# EAGLE design 511_outin_things_imx7 (EAGLE 9.6.2)
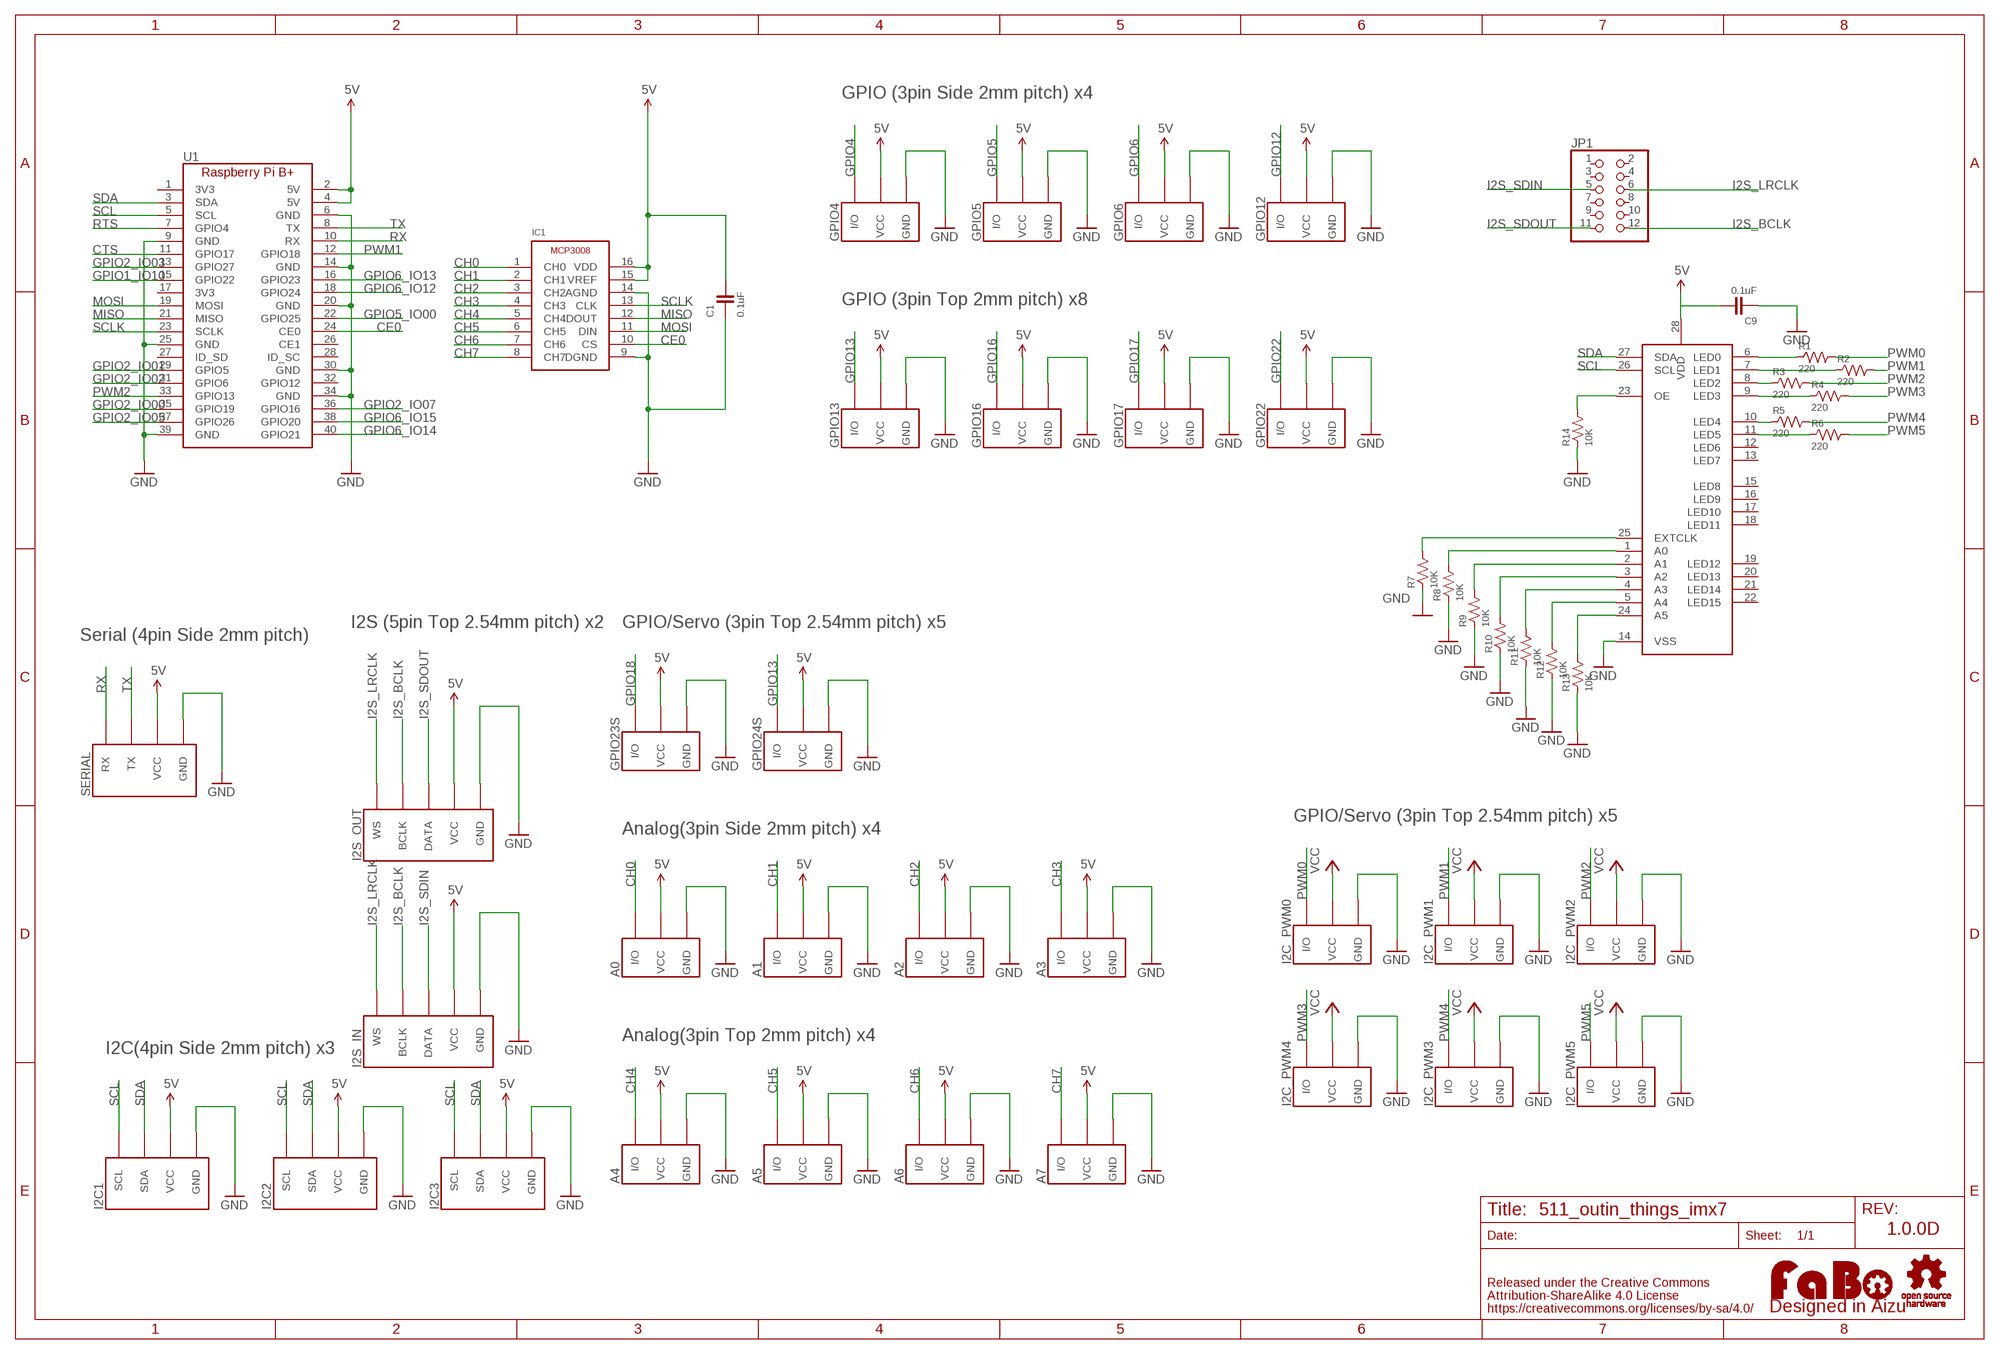
[diagram p0: schematic, sheet 1]

## Parts
A0  FABO_BRICK_3PIN-S03B-PASK-2  [FABO_BRICK_3PIN_S03B-PASK-2]
A1  FABO_BRICK_3PIN-S03B-PASK-2  [FABO_BRICK_3PIN_S03B-PASK-2]
A2  FABO_BRICK_3PIN-S03B-PASK-2  [FABO_BRICK_3PIN_S03B-PASK-2]
A3  FABO_BRICK_3PIN-S03B-PASK-2  [FABO_BRICK_3PIN_S03B-PASK-2]
A4  FABO_BRICK_3PIN-B03B-PASK-1  [FABO_BRICK_3PIN_B03B-PASK-1]
A5  FABO_BRICK_3PIN-B03B-PASK-1  [FABO_BRICK_3PIN_B03B-PASK-1]
A6  FABO_BRICK_3PIN-B03B-PASK-1  [FABO_BRICK_3PIN_B03B-PASK-1]
A7  FABO_BRICK_3PIN-B03B-PASK-1  [FABO_BRICK_3PIN_B03B-PASK-1]
C1  0.1uF  CAPACITOR-0603  [0603]
C9  0.1uF  CAPACITOR-0603  [0603]
GPIO4  FABO_BRICK_3PIN-S03B-PASK-2  [FABO_BRICK_3PIN_S03B-PASK-2]
GPIO5  FABO_BRICK_3PIN-S03B-PASK-2  [FABO_BRICK_3PIN_S03B-PASK-2]
GPIO6  FABO_BRICK_3PIN-S03B-PASK-2  [FABO_BRICK_3PIN_S03B-PASK-2]
GPIO12  FABO_BRICK_3PIN-S03B-PASK-2  [FABO_BRICK_3PIN_S03B-PASK-2]
GPIO13  FABO_BRICK_3PIN-B03B-PASK-1  [FABO_BRICK_3PIN_B03B-PASK-1]
GPIO16  FABO_BRICK_3PIN-B03B-PASK-1  [FABO_BRICK_3PIN_B03B-PASK-1]
GPIO17  FABO_BRICK_3PIN-B03B-PASK-1  [FABO_BRICK_3PIN_B03B-PASK-1]
GPIO22  FABO_BRICK_3PIN-B03B-PASK-1  [FABO_BRICK_3PIN_B03B-PASK-1]
GPIO23S  FABO_BRICK_3PIN-HEADER  [FABO_BRICK_3PIN_HEADER]
GPIO24S  FABO_BRICK_3PIN-HEADER  [FABO_BRICK_3PIN_HEADER]
I2C1  FABO_BRICK_I2C-S04B-PASK-2  [FABO_BRICK_I2C_S04B-PASK-2]
I2C2  FABO_BRICK_I2C-S04B-PASK-2  [FABO_BRICK_I2C_S04B-PASK-2]
I2C3  FABO_BRICK_I2C-S04B-PASK-2  [FABO_BRICK_I2C_S04B-PASK-2]
I2C_PWM0  FABO_BRICK_3PIN-HEADER  [FABO_BRICK_3PIN_HEADER]
I2C_PWM1  FABO_BRICK_3PIN-HEADER  [FABO_BRICK_3PIN_HEADER]
I2C_PWM2  FABO_BRICK_3PIN-HEADER  [FABO_BRICK_3PIN_HEADER]
I2C_PWM3  FABO_BRICK_3PIN-HEADER  [FABO_BRICK_3PIN_HEADER]
I2C_PWM4  FABO_BRICK_3PIN-HEADER  [FABO_BRICK_3PIN_HEADER]
I2C_PWM5  FABO_BRICK_3PIN-HEADER  [FABO_BRICK_3PIN_HEADER]
I2S_IN  FABO_BRICK_I2STOP  [FABO_BRICK_I2S_B05B-PARK-1]
I2S_OUT  FABO_BRICK_I2STOP  [FABO_BRICK_I2S_B05B-PARK-1]
IC1  MICROCHIP-MCP3008  [MICROCHIP-MCP3008]
JP1  PINHD-2X6  [2X06]
LOGO1  LOGO_FABO-M  [LOGO_FABO_M]
R1  220  RESISTOR-0603  [0603]
R2  220  RESISTOR-0603  [0603]
R3  220  RESISTOR-0603  [0603]
R4  220  RESISTOR-0603  [0603]
R5  220  RESISTOR-0603  [0603]
R6  220  RESISTOR-0603  [0603]
R7  10K  RESISTOR-0603  [0603]
R8  10K  RESISTOR-0603  [0603]
R9  10K  RESISTOR-0603  [0603]
R10  10K  RESISTOR-0603  [0603]
R11  10K  RESISTOR-0603  [0603]
R12  10K  RESISTOR-0603  [0603]
R13  10K  RESISTOR-0603  [0603]
R14  10K  RESISTOR-0603  [0603]
SERIAL  FABO_BRICK_SERIAL-S04B-PASK-2  [FABO_BRICK_SERIAL_S04B-PASK-2]
U1  RASPBERRY_PI_B+  [RASPBERRY_PI_B+]
U$4  LOGO_OSHW-T_M_BOTTOM  [LOGO_OSHW_T_MS_BOTTOM]
U$9  PCA9685  [PCA9685]

## Nets
5V: A0.VCC A1.VCC A2.VCC A3.VCC A4.VCC A5.VCC A6.VCC A7.VCC C1.2 C9.2 GPIO4.VCC GPIO5.VCC GPIO6.VCC GPIO12.VCC GPIO13.VCC GPIO16.VCC GPIO17.VCC GPIO22.VCC GPIO23S.VCC GPIO24S.VCC I2C1.VCC I2C2.VCC I2C3.VCC I2S_IN.VCC I2S_OUT.VCC IC1.15(VREF) IC1.16(VDD) SERIAL.VCC U1.2(5V) U1.4(5V) U$9.28(VDD)
CE0: IC1.10(CS) U1.24(CE0)
CH0: A0.I/O IC1.1(CH0)
CH1: A1.I/O IC1.2(CH1)
CH2: A2.I/O IC1.3(CH2)
CH3: A3.I/O IC1.4(CH3)
CH4: A4.I/O IC1.5(CH4)
CH5: A5.I/O IC1.6(CH5)
CH6: A6.I/O IC1.7(CH6)
CH7: A7.I/O IC1.8(CH7)
CTS: U1.11(GPIO17)
GND: A0.GND A1.GND A2.GND A3.GND A4.GND A5.GND A6.GND A7.GND C1.1 C9.1 GPIO4.GND GPIO5.GND GPIO6.GND GPIO12.GND GPIO13.GND GPIO16.GND GPIO17.GND GPIO22.GND GPIO23S.GND GPIO24S.GND I2C1.GND I2C2.GND I2C3.GND I2C_PWM0.GND I2C_PWM1.GND I2C_PWM2.GND I2C_PWM3.GND I2C_PWM4.GND I2C_PWM5.GND I2S_IN.GND I2S_OUT.GND IC1.9(DGND) IC1.14(AGND) R7.1 R8.1 R9.1 R10.1 R11.1 R12.1 R13.1 R14.1 SERIAL.GND U1.6(GND) U1.9(GND) U1.14(GND) U1.20(GND) U1.25(GND) U1.30(GND) U1.34(GND) U1.39(GND) U$9.14(VSS)
GPIO1_IO10: U1.15(GPIO22)
GPIO2_IO00: U1.35(GPIO19)
GPIO2_IO01: U1.29(GPIO5)
GPIO2_IO02: U1.31(GPIO6)
GPIO2_IO03: U1.13(GPIO27)
GPIO2_IO05: U1.37(GPIO26)
GPIO2_IO07: U1.36(GPIO16)
GPIO4: GPIO4.I/O
GPIO5: GPIO5.I/O
GPIO5_IO00: U1.22(GPIO25)
GPIO6: GPIO6.I/O
GPIO6_IO12: U1.18(GPIO24)
GPIO6_IO13: U1.16(GPIO23)
GPIO6_IO14: U1.40(GPIO21)
GPIO6_IO15: U1.38(GPIO20)
GPIO12: GPIO12.I/O
GPIO13: GPIO13.I/O GPIO24S.I/O
GPIO16: GPIO16.I/O
GPIO17: GPIO17.I/O
GPIO18: GPIO23S.I/O
GPIO22: GPIO22.I/O
I2S_BCLK: I2S_IN.BCLK I2S_OUT.BCLK JP1.12
I2S_LRCLK: I2S_IN.WS I2S_OUT.WS JP1.6
I2S_SDIN: I2S_IN.DATA JP1.5
I2S_SDOUT: I2S_OUT.DATA JP1.11
LED0: R1.1 U$9.6(LED0)
LED1: R2.1 U$9.7(LED1)
LED2: R3.1 U$9.8(LED2)
LED3: R4.1 U$9.9(LED3)
LED4: R5.1 U$9.10(LED4)
LED5: R6.1 U$9.11(LED5)
MISO: IC1.12(DOUT) U1.21(MISO)
MOSI: IC1.11(DIN) U1.19(MOSI)
N$7: R14.2 U$9.23(OE)
N$8: R7.2 U$9.25(EXTCLK)
N$9: R8.2 U$9.1(A0)
N$10: R9.2 U$9.2(A1)
N$11: R10.2 U$9.3(A2)
N$12: R11.2 U$9.4(A3)
N$13: R12.2 U$9.5(A4)
N$14: R13.2 U$9.24(A5)
PWM0: I2C_PWM0.I/O R1.2
PWM1: I2C_PWM1.I/O R2.2 U1.12(GPIO18)
PWM2: I2C_PWM2.I/O R3.2 U1.33(GPIO13)
PWM3: I2C_PWM4.I/O R4.2
PWM4: I2C_PWM3.I/O R5.2
PWM5: I2C_PWM5.I/O R6.2
RTS: U1.7(GPIO4)
RX: SERIAL.RX U1.10(RX)
SCL: I2C1.SCL I2C2.SCL I2C3.SCL U1.5(SCL) U$9.26(SCL)
SCLK: IC1.13(CLK) U1.23(SCLK)
SDA: I2C1.SDA I2C2.SDA I2C3.SDA U1.3(SDA) U$9.27(SDA)
TX: SERIAL.TX U1.8(TX)
VCC: I2C_PWM0.VCC I2C_PWM1.VCC I2C_PWM2.VCC I2C_PWM3.VCC I2C_PWM4.VCC I2C_PWM5.VCC
Unconnected: JP1.1 JP1.2 JP1.3 JP1.4 JP1.7 JP1.8 JP1.9 JP1.10 U1.1(3V3) U1.17(3V3) U1.26(CE1) U1.27(ID_SD) U1.28(ID_SC) U1.32(GPIO12) U$9.12(LED6) U$9.13(LED7) U$9.15(LED8) U$9.16(LED9) U$9.17(LED10) U$9.18(LED11) U$9.19(LED12) U$9.20(LED13) U$9.21(LED14) U$9.22(LED15)

## Notes on the sheet
- GPIO (3pin Side 2mm pitch) x4
- GPIO (3pin Top 2mm pitch) x8
- I2S (5pin Top 2.54mm pitch) x2 | GPIO/Servo (3pin Top 2.54mm pitch) x5
- Serial (4pin Side 2mm pitch)
- GPIO/Servo (3pin Top 2.54mm pitch) x5
- Analog(3pin Side 2mm pitch) x4
- Analog(3pin Top 2mm pitch) x4
- I2C(4pin Side 2mm pitch) x3
- 1.0.0D

## Library data of the parts
A0 A1-A7 GPIO4-GPIO6 GPIO12 GPIO13 GPIO16 GPIO17 GPIO22 GPIO23S GPIO24S I2C_PWM0 I2C_PWM1-I2C_PWM5 = FaBo-Template:FABO_BRICK_3PIN: FaBo Brick 3pin
C1 C9 = FaBo-Capacitor:CAPACITOR: CAPACITOR
I2C1-I2C3 = FaBo-Template:FABO_BRICK_I2C: FaBo Brick I2C
I2S_IN I2S_OUT = FaBo-Template:FABO_BRICK_I2S
IC1 = FaBo-ADC:MICROCHIP-MCP3008
JP1 = pinhead:PINHD-2X6: PIN HEADER
LOGO1 = component:LOGO_FABO
R1-R14 = FaBo-Resistors:RESISTOR: RESISTOR
SERIAL = FaBo-Template:FABO_BRICK_SERIAL: FaBo Brick Serial
U1 = FaBo-Boards:RASPBERRY_PI_B+
U$4 = FaBo-etc:LOGO_OSHW
U$9 = FaBo-Motor:PCA9685

## Board
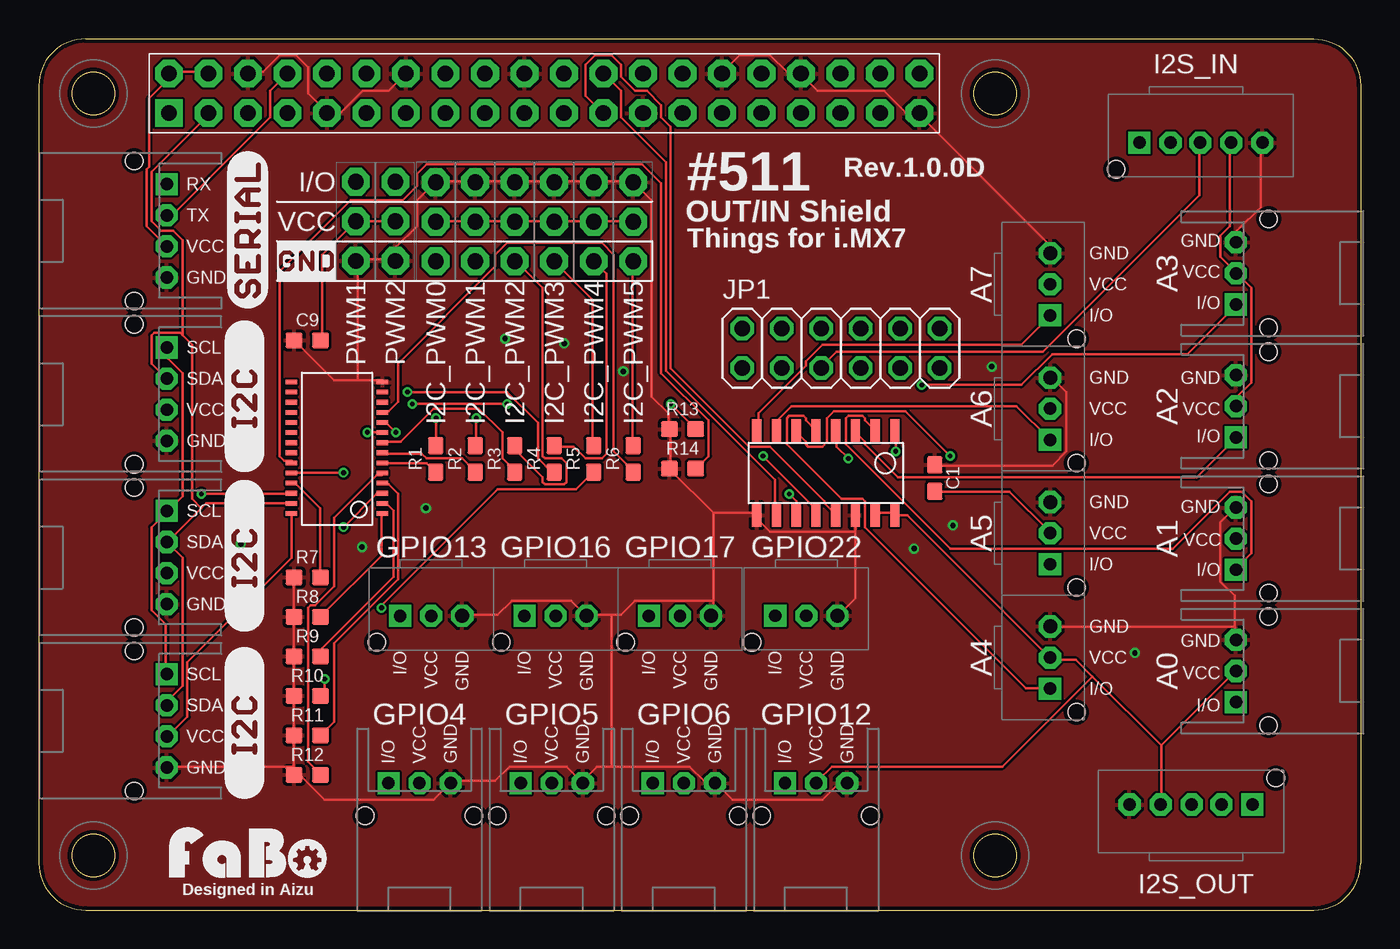
[diagram p1: board, top side]
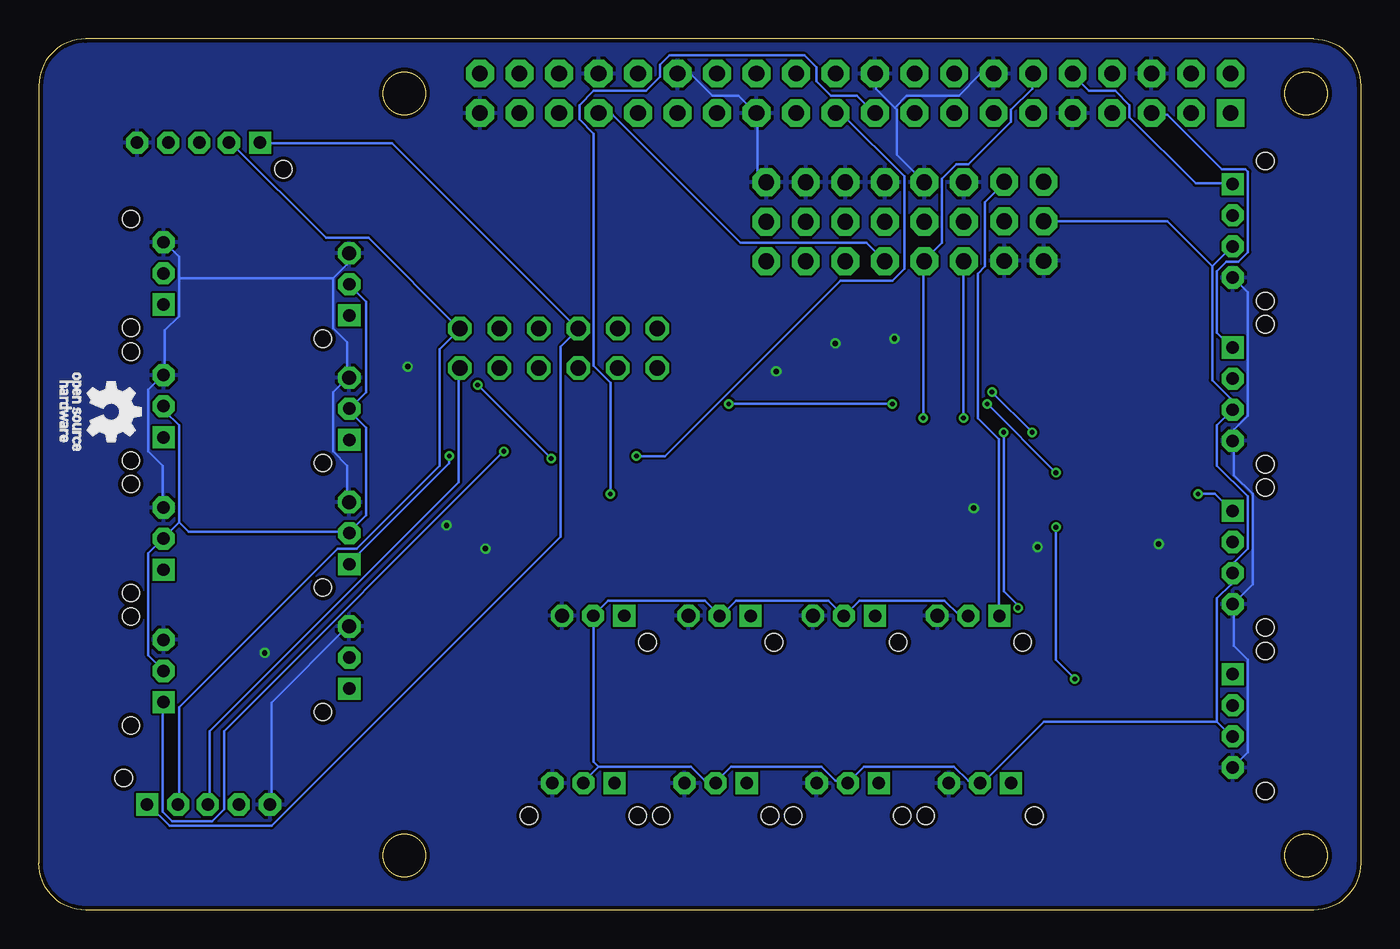
[diagram p2: board, bottom side, seen from below]

Size 85 x 56 mm. Coordinates in mm from the lower left corner, seen from the top.
Copper layers (1*16): Top 0.035mm / dielectric 1.6mm / Bottom 0.035mm
Design rules "PCBway": minimum track width 6mil, minimum drill 12mil, track to track 6mil, track to pad 6mil, pad to pad 6mil, via to via 6mil, smd to smd 6mil, copper to edge 10mil, drill to drill 10mil, minimum pad ring 10mil, minimum via ring 6mil, stop-mask expansion 2mil, vias tented up to drill 100mil, thermal gap 8mil

### Footprints (pad centres in the part's own frame; a part is rotated, then mirrored left to right if it is on the bottom)
FABO_BRICK_3PIN_S03B-PASK-2 = drill 0.8 pad 1.422 octagon: GND -2,0; VCC 0,0 | drill 0.8 pad 1.422 square: I/O 2,0 | hole 1.1: 3.5,2.1; -3.5,2.1
FABO_BRICK_3PIN_B03B-PASK-1 = drill 0.9 pad 1.422 octagon: GND -2,0 | drill 0.8 pad 1.422 square: I/O 2,0 | drill 0.8 pad 1.422 octagon: VCC 0,0 | hole 1.1: 3.5,1.7
0603 = smd 1.1 x 1: 1 -0.85,0; 2 0.85,0
FABO_BRICK_3PIN_HEADER = drill 1 pad 1.778 octagon: GND -2.54,0; I/O 2.54,0; VCC 0,0
FABO_BRICK_I2C_S04B-PASK-2 = drill 0.8 pad 1.422 octagon: GND -3,0; SDA 1,0; VCC -1,0 | drill 0.8 pad 1.422 square: SCL 3,0 | hole 1.1: 4.5,2.1; -4.5,2.1
FABO_BRICK_I2S_B05B-PARK-1 = drill 0.8 pad 1.422 octagon: BCLK 1.635,2.54; DATA -0.27,2.54; GND -4.27,2.54; VCC -2.27,2.54 | drill 0.8 pad 1.422 square: WS 3.635,2.54 | hole 1.1: 5.135,4.24
MICROCHIP-MCP3008 = smd 0.6 x 1.5: 1 -4.445,-2.7; 2 -3.175,-2.7; 3 -1.905,-2.7; 4 -0.635,-2.7; 5 0.635,-2.7; 6 1.905,-2.7; 7 3.175,-2.7; 8 4.445,-2.7; 9 4.445,2.7; 10 3.175,2.7; 11 1.905,2.7; 12 0.635,2.7; 13 -0.635,2.7; 14 -1.905,2.7; 15 -3.175,2.7; 16 -4.445,2.7
2X06 = drill 1.016 octagon: 1 -6.35,-1.27; 2 -6.35,1.27; 3 -3.81,-1.27; 4 -3.81,1.27; 5 -1.27,-1.27; 6 -1.27,1.27; 7 1.27,-1.27; 8 1.27,1.27; 9 3.81,-1.27; 10 3.81,1.27; 11 6.35,-1.27; 12 6.35,1.27
FABO_BRICK_SERIAL_S04B-PASK-2 = drill 0.8 pad 1.422 octagon: GND -3,0; TX 1,0; VCC -1,0 | drill 0.8 pad 1.422 square: RX 3,0 | hole 1.1: 4.5,2.1; -4.5,2.1
RASPBERRY_PI_B+ = drill 1 pad 1.778 square: 1 0,-2.54 | drill 1 pad 1.778 octagon: 2 0,0; 3 2.54,-2.54; 4 2.54,0; 5 5.08,-2.54; 6 5.08,0; 7 7.62,-2.54; 8 7.62,0; 9 10.16,-2.54; 10 10.16,0; 11 12.7,-2.54; 12 12.7,0; 13 15.24,-2.54; 14 15.24,0; 15 17.78,-2.54; 16 17.78,0; 17 20.32,-2.54; 18 20.32,0; 19 22.86,-2.54; 20 22.86,0; 21 25.4,-2.54; 22 25.4,0; 23 27.94,-2.54; 24 27.94,0; 25 30.48,-2.54; 26 30.48,0; 27 33.02,-2.54; 28 33.02,0; 29 35.56,-2.54; 30 35.56,0; 31 38.1,-2.54; 32 38.1,0; 33 40.64,-2.54; 34 40.64,0; 35 43.18,-2.54; 36 43.18,0; 37 45.72,-2.54; 38 45.72,0; 39 48.26,-2.54; 40 48.26,0
PCA9685 = smd 0.3 x 0.75: 1 -4.15,-2.93; 2 -3.5,-2.93; 3 -2.85,-2.93; 4 -2.2,-2.93; 5 -1.55,-2.93; 6 -0.9,-2.93; 7 -0.25,-2.93; 8 0.4,-2.93; 9 1.05,-2.93; 10 1.7,-2.93; 11 2.35,-2.93; 12 3,-2.93; 13 3.65,-2.93; 14 4.3,-2.93; 15 4.3,2.92; 16 3.65,2.92; 17 3,2.92; 18 2.35,2.92; 19 1.7,2.92; 20 1.05,2.92; 21 0.4,2.92; 22 -0.25,2.92; 23 -0.9,2.92; 24 -1.55,2.92; 25 -2.2,2.92; 26 -2.85,2.92; 27 -3.5,2.92; 28 -4.15,2.92

### Placement (x,y rotation side)
A0  76.98,15.36 270 top
A1  76.98,23.88 270 top
A2  76.98,32.39 270 top
A3  76.98,40.93 270 top
A4  65.03,16.23 270 top
A5  65.03,24.23 270 top
A6  65.03,32.23 270 top
A7  65.03,40.23 270 top
C1  57.62,27.76 270 top
C9  17.26,36.63 0 top
GPIO4  24.48,8.16 180 top
GPIO5  32.98,8.16 180 top
GPIO6  41.48,8.16 180 top
GPIO12  49.98,8.16 180 top
GPIO13  25.23,18.91 180 top
GPIO16  33.23,18.91 180 top
GPIO17  41.23,18.91 180 top
GPIO22  49.36,18.92 180 top
GPIO23S  20.38,44.28 90 top
GPIO24S  22.91,44.28 90 top
I2C1  8.23,33.16 90 top
I2C2  8.23,22.66 90 top
I2C3  8.23,12.16 90 top
I2C_PWM0  25.52,44.25 270 top
I2C_PWM1  28.05,44.25 270 top
I2C_PWM2  30.59,44.25 270 top
I2C_PWM3  33.13,44.25 270 top
I2C_PWM4  35.67,44.25 270 top
I2C_PWM5  38.21,44.25 270 top
I2S_IN  74.41,51.87 180 top
I2S_OUT  74.41,4.24 0 top
IC1  50.61,28.09 180 top
JP1  51.58,36.11 0 top
LOGO1  13.45,1.7 0 top
R1  25.52,29.01 90 top
R2  28.05,29.01 90 top
R3  30.59,29.01 90 top
R4  33.13,29.01 90 top
R5  35.67,29.01 90 top
R6  38.21,29.01 90 top
R7  17.26,21.39 0 top
R8  17.26,18.85 0 top
R9  17.26,16.31 0 top
R10  17.26,13.77 0 top
R11  17.26,11.23 0 top
R12  17.26,8.69 0 top
R13  41.39,30.91 0 top
R14  41.39,28.37 0 top
SERIAL  8.23,43.66 90 top
U1  8.37,53.77 0 top
U$2  [LOGO_SILK_I2C]  14.48,17.91 90 top
U$3  [LOGO_SILK_SERIAL2]  14.73,38.66 90 top
U$4  80.38,32.01 90 top
U$5  [LOGO_SILK_I2C]  14.48,7.16 90 top
U$6  [LOGO_SILK_I2C]  14.48,28.16 90 top
U$7  [LOGO_SILK_GND]  15.29,40.47 0 top
U$9  19.16,29.64 90 top

### Tracks (layer width: path | path; a pad name or v marks a point on that pad's centre or on a via)
5V
  Top 0.152: C1.2 57.7,26.9 62.42,26.9 65.01,24.31 A5.VCC | IC1.15 53.89,25.53 54.95,25.53 IC1.16 55.11,25.37 55.87,25.37 65.01,16.23 A4.VCC 65.16,16.08 66.69,16.08 67.76,15.01 | A2.VCC 77.05,32.54 77.05,32.99 77.97,33.91 77.97,40 77.05,40.92 A3.VCC 76.9,41.07 75.98,41.98 75.98,43.36 76.59,43.97 76.59,49.3 I2S_IN.VCC | 72.17,10.59 72.17,6.78 I2S_OUT.VCC | 72.17,10.59 76.9,15.31 A0.VCC | 72.17,10.59 67.76,15.01 | U$9.28 16.24,25.37 16.24,22.63 9.54,15.92 9.54,12.42 8.32,11.2 I2C3.VCC | C9.2 18.23,36.65 18.23,42.14 GPIO23S.VCC 20.51,44.27 22.8,44.27 GPIO24S.VCC | U1.4 10.91,53.87 8.47,53.87 U1.2 8.32,53.72 8.32,53.41 7.1,52.2 7.1,47.78 6.95,47.62 6.95,43.97 8.17,42.75 SERIAL.VCC | 67.76,15.01 61.96,9.22 50.99,9.22 50.08,8.3 GPIO12.VCC
  Bottom 0.152: A7.VCC 65.01,40.16 63.95,39.09 63.95,33.3 65.01,32.23 A6.VCC 65.01,32.08 63.95,31.01 63.95,25.37 65.01,24.31 A5.VCC 65.16,24.31 75.38,24.31 75.98,24.92 | A0.VCC 77.05,15.47 77.97,16.38 77.97,22.93 77.05,23.85 A1.VCC 76.9,24 75.98,24.92 | 75.98,24.92 75.98,31.16 76.9,32.08 76.9,32.38 A2.VCC | GPIO13.VCC 25.24,18.97 25.84,18.97 26.76,19.89 32.25,19.89 33.16,18.97 GPIO16.VCC 33.31,18.97 34.23,19.89 40.17,19.89 41.08,18.97 GPIO17.VCC 41.24,18.97 42.15,19.89 48.4,19.89 49.31,18.97 GPIO22.VCC 49.31,18.82 49.31,9.52 49.01,9.22 | 49.01,9.22 43.07,9.22 42.15,8.3 41.54,8.3 GPIO6.VCC 41.39,8.3 40.48,9.22 34.68,9.22 33.77,8.3 33.01,8.3 GPIO5.VCC 32.86,8.3 31.94,9.22 26.15,9.22 25.24,8.3 24.63,8.3 GPIO4.VCC 24.47,8.3 24.17,8.3 20.36,12.11 9.23,12.11 | 49.01,9.22 49.92,8.3 GPIO12.VCC | 9.23,12.11 9.23,20.04 8.32,20.95 8.32,21.56 I2C2.VCC 8.17,21.72 8.17,22.33 7.25,23.24 7.25,26.59 9.23,28.57 9.23,31.16 8.32,32.08 I2C1.VCC 8.32,32.23 8.32,32.84 9.54,34.06 9.54,41.38 | 9.23,12.11 8.32,11.2 I2C3.VCC | 9.54,41.38 8.32,42.59 SERIAL.VCC | 9.54,41.38 12.43,44.27 GPIO23S.VCC
CE0
  Top 0.152: U1.24 37.43,52.65 37.43,50.98 40.32,48.08 40.32,34.67 47.33,27.66 47.33,25.53 IC1.10
CH0  (via drill 0.3)
  Top 0.152: v55.11,29.49 55.11,30.71 IC1.1
  Bottom 0.152: v55.11,29.49 73.09,11.5 73.09,6.48 73.85,5.71 76.44,5.71 77.05,6.32 77.05,13.33 A0.I/O
CH1
  Top 0.152: IC1.2 53.73,30.86 53.12,31.47 53.12,31.62 52.97,31.77 52.06,31.77 51.91,31.62 51.91,29.95 58.61,23.24 72.94,23.24 76.59,26.9 77.36,26.9 77.97,26.29 77.97,22.93 77.05,22.02 A1.I/O
CH2
  Top 0.152: IC1.3 52.51,30.71 53.12,30.1 53.12,29.95 55.26,27.81 74.46,27.81 76.9,30.25 A2.I/O
CH3  (via drill 0.3)
  Top 0.152: v52.06,29.03 51.3,29.79 51.3,30.71 IC1.4 | v56.78,33.76 63.18,33.76 65.16,35.74 73.85,35.74 76.9,38.78 A3.I/O
  Bottom 0.152: v56.78,33.76 v52.06,29.03
CH4
  Top 0.152: IC1.5 49.92,30.86 49.31,31.47 49.31,31.62 49.16,31.77 48.25,31.77 48.1,31.62 48.1,29.95 51.6,26.44 52.97,26.44 53.12,26.29 53.12,24.61 63.49,14.25 65.01,14.25 A4.I/O
CH5  (via drill 0.3)
  Top 0.152: v58.61,29.18 55.72,32.08 51.14,32.08 50.69,31.62 50.69,30.1 50.38,29.79 49.47,29.79 49.31,29.95 49.31,30.1 48.7,30.71 IC1.6
  Bottom 0.152: v58.61,29.18 58.61,28.73 65.01,22.33 A5.I/O
CH6
  Top 0.152: IC1.7 47.49,30.86 47.49,31.47 48.4,32.38 62.88,32.38 65.01,30.25 A6.I/O
CH7
  Top 0.152: IC1.8 46.27,30.86 46.27,31.93 49.31,34.97 49.31,35.28 50.38,36.35 63.18,36.35 65.01,38.17 A7.I/O
GND  (via drill 0.35)
  Top 0.152: 16.4,9.22 16.4,11.2 R11.1 16.4,11.35 16.4,13.64 R10.1 16.4,13.79 16.4,16.23 R9.1 16.4,16.38 16.4,18.82 R8.1 16.4,18.97 16.4,21.26 R7.1 | 16.4,9.22 16.4,8.76 R12.1 16.55,8.61 16.85,8.61 18.38,7.09 25.39,7.09 26.45,8.15 GPIO4.GND 26.61,8.3 29.35,8.3 30.27,9.22 33.92,9.22 34.84,8.3 GPIO5.GND 34.99,8.3 35.9,9.22 36.82,9.22 | 16.4,9.22 8.32,9.22 I2C3.GND | 36.82,9.22 41.85,9.22 42.76,8.3 43.37,8.3 GPIO6.GND 43.52,8.15 44.59,7.09 50.38,7.09 51.45,8.15 51.91,8.15 GPIO12.GND | GPIO13.GND 27.37,18.97 29.5,18.97 30.42,19.89 34.23,19.89 35.14,18.97 GPIO16.GND 35.29,18.97 36.82,18.97 | 52.51,24.31 52.51,20.04 51.45,18.97 GPIO22.GND | 52.51,24.31 IC1.14 | 43.37,25.53 46.11,25.53 IC1.9 46.27,25.37 46.27,25.07 47.03,24.31 52.51,24.31 | 43.37,25.53 40.63,28.27 R14.1 40.63,28.42 40.63,30.86 R13.1 40.48,31.01 40.48,31.93 39.41,32.99 39.41,45.64 38.34,46.71 I2C_PWM5.GND 38.19,46.86 35.75,46.86 I2C_PWM4.GND 35.6,46.86 33.16,46.86 I2C_PWM3.GND 33.01,46.86 30.72,46.86 I2C_PWM2.GND 30.57,46.86 28.13,46.86 I2C_PWM1.GND 27.98,46.86 25.54,46.86 I2C_PWM0.GND 25.39,46.71 24.32,45.64 24.32,43.97 22.95,42.59 22.95,41.83 GPIO24S.GND 22.8,41.83 20.51,41.83 GPIO23S.GND 20.51,41.68 20.51,34.06 | 43.37,25.53 43.37,19.89 | 43.37,19.89 43.37,18.97 GPIO17.GND | 36.82,18.97 37.43,18.97 38.34,19.89 43.37,19.89 | 36.82,18.97 36.82,9.22 | C1.1 57.7,28.57 65.16,28.57 66.08,29.49 66.08,33.3 65.16,34.21 A6.GND | 76.9,18.21 76.9,20.19 75.98,21.11 75.98,24.92 76.9,25.83 A1.GND | 76.9,18.21 76.9,17.45 A0.GND | I2S_IN.GND 78.58,49.3 78.58,45.19 77.05,43.66 77.05,43.05 A3.GND
  Top 0.152: 76.9,18.21 65.16,18.21 A4.GND | U1.30 43.98,53.87 45.05,54.94 47.03,54.94 48.1,53.87 49.01,53.87 U1.34 49.01,53.72 50.08,52.65 54.34,52.65 55.72,51.28 56.63,51.28 U1.39 56.63,51.13 65.01,42.75 65.01,42.29 A7.GND | 18.53,51.28 19.44,51.28 20.82,52.65 22.49,52.65 U1.14 | 18.53,51.28 17.31,52.5 17.31,54.18 16.55,54.94 15.48,54.94 14.41,53.87 13.5,53.87 U1.6 | 18.53,51.28 U1.9 | 20.51,34.06 18.99,34.06 16.55,36.5 C9.1 | 20.51,34.06 22.03,34.06 U$9.14
  Bottom 0.152: SERIAL.GND 8.17,40.61 7.25,39.7 7.25,31.77 8.17,30.86 8.17,30.25 I2C1.GND 8.17,30.1 8.17,27.96 6.95,26.74 6.95,20.95 8.17,19.73 I2C2.GND 8.17,19.58 8.17,16.99 7.25,16.08 7.25,10.13 8.17,9.22 I2C3.GND | A5.GND 65.16,26.29 65.16,28.57 66.08,29.49 66.08,33.3 65.16,34.21 A6.GND 65.16,34.36 65.16,36.5 66.08,37.41 66.08,40.61 | 66.08,40.61 65.16,41.53 65.16,42.14 A7.GND | I2S_OUT.GND 70.04,6.78 70.04,13.33 65.16,18.21 A4.GND | 75.98,40.61 75.98,41.98 76.9,42.9 A3.GND | 75.98,40.61 75.98,38.17 76.9,37.26 76.9,34.52 A2.GND 77.05,34.36 77.97,33.45 77.97,29.49 77.05,28.57 77.05,25.98 A1.GND | 75.98,40.61 66.08,40.61 | I2C_PWM5.GND 38.34,46.86 38.8,47.32 38.8,51.13 U1.25 38.95,51.28 40.02,52.35 41.7,52.35 43.07,53.72 43.83,53.72 U1.30 | 29.96,51.59 29.81,51.43 29.81,48.54 I2C_PWM1.GND | 29.96,51.59 31.18,52.81 31.18,53.72 U1.20 | 29.96,51.59 29.2,52.35 25.84,52.35 24.47,53.72 23.71,53.72 U1.14
  other vias: 24.88,25.83 20.78,23.33 12.98,23.53 29.98,36.73 56.28,23.23 70.48,16.53 58.78,24.73 61.28,34.93 33.78,36.43 37.58,34.63
  pour Bottom: -0.52,-0.84 -0.52,56.31 85.84,56.31 85.84,-0.84
  pour Top: -0.52,-0.84 -0.52,56.31 85.84,56.31 85.84,-0.84
GPIO13
  Bottom 0.152: GPIO13.I/O 23.25,18.97 23.25,30.25 24.63,31.62 24.63,40.92 24.17,41.38 24.17,45.49 22.95,46.71 GPIO24S.I/O
I2S_BCLK
  Bottom 0.152: I2S_IN.BCLK 72.63,49.3 66.54,43.2 63.79,43.2 58,37.41 JP1.12 58,37.26 59.22,36.04 59.22,28.57 64.56,23.24 65.77,23.24 75.98,13.03 75.98,6.78 I2S_OUT.BCLK
I2S_LRCLK
  Bottom 0.152: I2S_IN.WS 70.65,49.3 62.27,49.3 50.38,37.41 JP1.6 50.38,37.26 51.45,36.19 51.45,24 70.04,5.41 76.59,5.41 77.97,6.78 I2S_OUT.WS
I2S_SDIN
  Top 0.152: I2S_IN.DATA 74.61,49.3 74.61,45.95 64.56,35.89 51.3,35.89 50.38,34.97 JP1.5
I2S_SDOUT
  Bottom 0.152: I2S_OUT.DATA 74,6.78 74,11.5 58,27.51 58,34.82 JP1.11
LED0
  Top 0.152: U$9.6 22.19,28.73 24.93,28.73 25.39,28.27 R1.1
LED1
  Top 0.152: U$9.7 22.19,29.34 24.63,29.34 24.93,29.03 27.22,29.03 27.98,28.27 R2.1
LED2
  Top 0.152: U$9.8 22.19,30.1 23.25,30.1 25.39,32.23 28.28,32.23 29.81,30.71 29.81,29.03 30.57,28.27 R3.1
LED3  (via drill 0.3)
  Top 0.152: v21.12,30.71 22.03,30.71 U$9.9 | v23.71,33.3 30.11,33.3 32.09,31.32 32.09,29.03 33.01,28.12 R4.1
  Bottom 0.152: v23.71,33.3 v21.12,30.71
LED4  (via drill 0.3)
  Top 0.152: v22.95,30.71 22.34,31.32 22.19,31.32 U$9.10 | v22.03,19.43 22.03,19.58 29.5,27.05 34.53,27.05 35.6,28.12 R5.1
  Bottom 0.152: v22.95,30.71 22.95,20.5 22.03,19.58 v22.03,19.43
LED5
  Top 0.152: U$9.11 22.19,32.08 22.49,32.08 23.1,32.69 23.1,35.13 29.35,41.38 29.35,42.14 30.11,42.9 36.21,42.9 36.97,42.14 36.97,29.49 38.19,28.27 R6.1
MISO  (via drill 0.3)
  Top 0.152: v46.57,29.18 49.92,25.83 49.92,25.53 IC1.12
  Bottom 0.152: v46.57,29.18 44.74,29.18 33.46,40.46 30.11,40.46 29.35,41.22 29.35,47.17 33.31,51.13 33.77,51.13 U1.21
MOSI  (via drill 0.3)
  Top 0.152: IC1.11 48.7,26.29 v48.25,26.74
  Bottom 0.152: v48.25,26.74 48.25,33.91 49.31,34.97 49.31,49.91 50.23,50.82 50.23,51.74 49.31,52.65 45.96,52.65 45.05,53.57 45.05,54.33 44.44,54.94 35.75,54.94 34.99,54.18 34.99,53.26 34.07,52.35 32.4,52.35 31.33,51.28 U1.19
N$7
  Top 0.152: U$9.23 16.24,28.88 15.79,28.88 15.48,29.18 15.48,41.07 20.05,45.64 23.41,45.64 24.32,46.56 24.32,47.32 24.93,47.93 38.8,47.93 40.02,46.71 40.02,34.52 43.07,31.47 43.07,29.18 42.3,28.42 R14.2
N$8
  Top 0.152: U$9.25 16.4,27.35 16.55,27.35 18.07,25.83 18.07,21.41 R7.2
N$9
  Top 0.152: U$9.1 22.03,25.37 22.03,22.78 18.23,18.97 R8.2
N$10
  Top 0.152: U$9.2 22.19,26.14 22.34,26.14 22.8,25.68 22.8,21.41 18.23,16.84 18.23,16.38 R9.2
N$11  (via drill 0.3)
  Top 0.152: v19.6,24.61 21.73,26.74 22.03,26.74 U$9.3 | v18.38,14.86 18.38,13.94 18.23,13.79 R10.2
  Bottom 0.152: v19.6,24.61 19.6,16.08 v18.38,14.86
N$12
  Top 0.152: U$9.4 22.19,27.35 22.49,27.35 23.1,26.74 23.1,21.26 18.99,17.14 18.99,12.11 18.23,11.35 R11.2
N$13
  Top 0.152: U$9.5 22.03,27.96 21.73,27.96 18.99,25.22 18.99,20.8 17.77,19.58 17.46,19.58 17.31,19.43 17.31,9.52 18.07,8.76 R12.2
N$14  (via drill 0.3)
  Top 0.152: v19.6,28.12 16.4,28.12 U$9.24 | v30.11,32.54 v24.02,32.54 | v40.63,32.54 42.15,31.01 R13.2
  Bottom 0.152: v24.02,32.54 v19.6,28.12 | v40.63,32.54 v30.11,32.54
PWM0  (via drill 0.3)
  Top 0.152: v25.54,31.62 25.54,29.95 R1.2
  Bottom 0.152: v25.54,31.62 25.54,41.68 I2C_PWM0.I/O
PWM1  (via drill 0.3)
  Top 0.152: v28.13,31.62 28.13,29.95 R2.2
  Bottom 0.152: v28.13,31.62 28.13,41.68 I2C_PWM1.I/O 27.98,41.83 26.91,42.9 26.91,47.01 26,47.93 25.24,47.93 22.49,50.67 22.49,51.43 21.12,52.81 21.12,53.72 U1.12
PWM2
  Top 0.152: R3.2 30.72,29.79 30.72,29.49 32.4,27.81 32.4,27.51 32.55,27.35 33.77,27.35 33.92,27.51 33.92,28.73 33.62,29.03 32.55,29.03 32.4,29.18 32.4,40 30.72,41.68 I2C_PWM2.I/O
  Bottom 0.152: I2C_PWM2.I/O 31.79,42.9 39.87,42.9 48.1,51.13 49.01,51.13 U1.33
PWM3
  Top 0.152: R4.2 33.16,29.79 34.38,29.79 35.14,29.03 36.21,29.03 36.51,29.34 36.51,40.92 35.75,41.68 I2C_PWM4.I/O
PWM4
  Top 0.152: I2C_PWM3.I/O 35.6,39.24 35.6,29.95 R5.2
PWM5
  Top 0.152: R6.2 38.19,29.95 38.19,41.68 I2C_PWM5.I/O
RX
  Bottom 0.152: SERIAL.RX 8.32,46.71 10.6,46.71 14.87,50.98 14.87,51.74 15.79,52.65 17.46,52.65 18.53,53.72 U1.10
SCL  (via drill 0.3)
  Top 0.152: v10.45,26.74 16.24,26.74 U$9.26 | I2C3.SCL 8.17,15.16 8.17,18.36 7.25,19.28 7.25,24.61 8.17,25.53 I2C2.SCL 8.32,25.68 9.23,26.59 9.23,34.52 8.32,35.43 8.32,36.04 I2C1.SCL
  Bottom 0.152: v10.45,26.74 9.39,26.74 8.32,25.68 I2C2.SCL | U1.5 13.35,51.13 12.43,51.13 8.93,47.62 7.4,47.62 7.25,47.47 7.25,42.29 7.86,41.68 8.62,41.68 9.23,41.07 9.23,37.11 8.32,36.19 I2C1.SCL
SCLK
  Top 0.152: IC1.13 51.14,25.53 50.53,26.14 50.53,26.29 47.03,29.79 45.66,29.79 40.63,34.82 40.63,50.37 40.02,50.98 40.02,51.74 39.1,52.65 38.34,52.65 37.43,53.57 37.43,54.33 36.82,54.94 35.75,54.94 35.14,54.33 35.14,52.35 36.21,51.28 U1.23
SDA
  Top 0.152: 10.45,25.83 8.32,23.7 I2C2.SDA 8.32,23.54 9.23,22.63 9.23,14.4 8.32,13.49 8.32,13.18 I2C3.SDA | 10.45,25.83 10.76,26.14 U$9.27 | 9.23,36.96 9.84,36.35 9.84,26.44 10.45,25.83 | 9.23,36.96 9.08,37.11 7.4,37.11 7.25,36.96 7.25,35.13 8.17,34.21 I2C1.SDA | 9.23,36.96 9.23,43.05 8.62,43.66 7.86,43.66 7.25,44.27 7.25,47.47 10.91,51.13 U1.3
TX
  Top 0.152: U1.8 14.87,52.65 14.87,50.98 8.62,44.73 8.32,44.73 SERIAL.TX
VCC
  Top 0.152: I2C_PWM5.VCC 38.19,44.27 35.75,44.27 I2C_PWM4.VCC 35.6,44.27 33.16,44.27 I2C_PWM3.VCC 33.01,44.27 30.72,44.27 I2C_PWM2.VCC 30.57,44.27 28.13,44.27 I2C_PWM1.VCC 27.98,44.27 25.54,44.27 I2C_PWM0.VCC

### Text on the board
tPlace: RX | I/O | Rev.1.0.0D | #511 | TX | VCC | OUT/IN Shield | VCC | GND | Things for i.MX7 | GND | GND | VCC | PWM1 | PWM2 | VCC | I/O | I/O | SCL | SDA | GND | GND | VCC | VCC | VCC | GND | I/O | I/O | GND | GND | SCL | VCC | VCC | SDA | I/O | I/O | VCC | GND | GND | I/O | VCC | GND | I/O | VCC | GND | I/O | VCC | GND | I/O | VCC | GND | GND | VCC | SCL | VCC | I/O | SDA | I/O | VCC | GND | I/O | VCC | GND | I/O | VCC | GND | I/O | VCC | GND | I/O | VCC | GND | Designed in Aizu